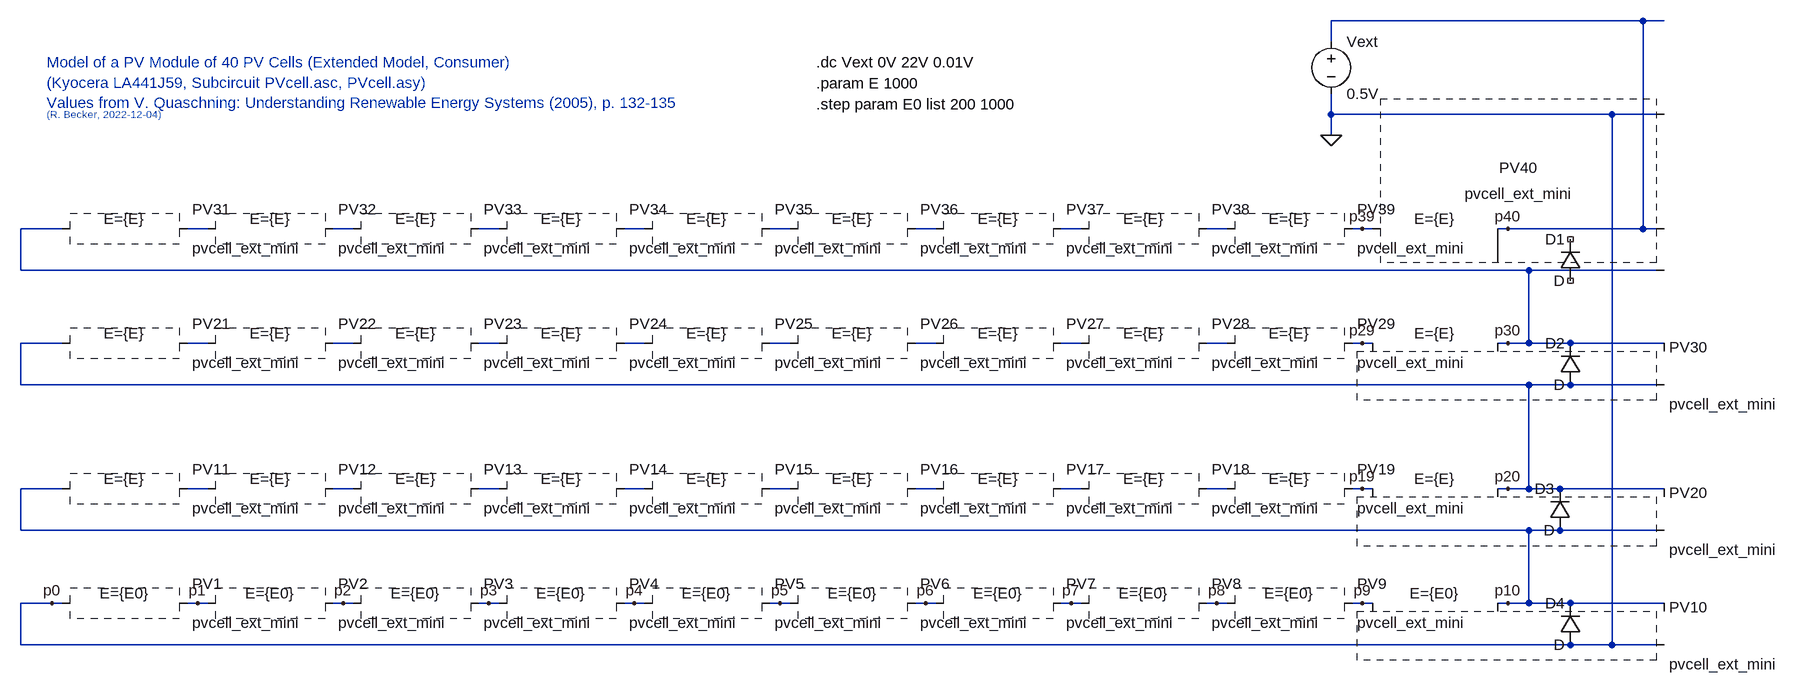
[diagram p0: schematic PVmodule_40_PVcell_Ext_Mini_V002.asc]
PVmodule_40_PVcell_Ext_Mini_V002.asc, the LTspice schematic file:
Version 4
SHEET 1 2048 1588
WIRE 1920 -16 1440 -16
WIRE 1952 -16 1920 -16
WIRE 1440 16 1440 -16
WIRE 1440 128 1440 96
WIRE 1872 128 1440 128
WIRE 1952 128 1872 128
WIRE 1440 160 1440 128
WIRE -512 304 -576 304
WIRE -288 304 -320 304
WIRE -64 304 -96 304
WIRE 160 304 128 304
WIRE 384 304 352 304
WIRE 608 304 576 304
WIRE 832 304 800 304
WIRE 1056 304 1024 304
WIRE 1280 304 1248 304
WIRE 1488 304 1472 304
WIRE 1504 304 1488 304
WIRE 1712 304 1696 304
WIRE 1920 304 1920 -16
WIRE 1920 304 1712 304
WIRE 1952 304 1920 304
WIRE -576 368 -576 304
WIRE 1744 368 -576 368
WIRE 1952 368 1744 368
WIRE -512 480 -576 480
WIRE -288 480 -320 480
WIRE -64 480 -96 480
WIRE 160 480 128 480
WIRE 384 480 352 480
WIRE 608 480 576 480
WIRE 832 480 800 480
WIRE 1056 480 1024 480
WIRE 1280 480 1248 480
WIRE 1488 480 1472 480
WIRE 1504 480 1488 480
WIRE 1712 480 1696 480
WIRE 1744 480 1744 368
WIRE 1744 480 1712 480
WIRE 1808 480 1744 480
WIRE 1952 480 1808 480
WIRE -576 544 -576 480
WIRE 1744 544 -576 544
WIRE 1808 544 1744 544
WIRE 1952 544 1808 544
WIRE -512 704 -576 704
WIRE -288 704 -320 704
WIRE -64 704 -96 704
WIRE 160 704 128 704
WIRE 384 704 352 704
WIRE 608 704 576 704
WIRE 832 704 800 704
WIRE 1056 704 1024 704
WIRE 1280 704 1248 704
WIRE 1488 704 1472 704
WIRE 1504 704 1488 704
WIRE 1712 704 1696 704
WIRE 1744 704 1744 544
WIRE 1744 704 1712 704
WIRE 1792 704 1744 704
WIRE 1952 704 1792 704
WIRE -576 768 -576 704
WIRE 1744 768 -576 768
WIRE 1792 768 1744 768
WIRE 1952 768 1792 768
WIRE -528 880 -576 880
WIRE -512 880 -528 880
WIRE -304 880 -320 880
WIRE -288 880 -304 880
WIRE -80 880 -96 880
WIRE -64 880 -80 880
WIRE 144 880 128 880
WIRE 160 880 144 880
WIRE 368 880 352 880
WIRE 384 880 368 880
WIRE 592 880 576 880
WIRE 608 880 592 880
WIRE 816 880 800 880
WIRE 832 880 816 880
WIRE 1040 880 1024 880
WIRE 1056 880 1040 880
WIRE 1264 880 1248 880
WIRE 1280 880 1264 880
WIRE 1488 880 1472 880
WIRE 1504 880 1488 880
WIRE 1712 880 1696 880
WIRE 1744 880 1744 768
WIRE 1744 880 1712 880
WIRE 1808 880 1744 880
WIRE 1952 880 1808 880
WIRE -576 944 -576 880
WIRE 1808 944 -576 944
WIRE 1872 944 1872 128
WIRE 1872 944 1808 944
WIRE 1952 944 1872 944
FLAG 1440 160 0
FLAG -528 880 p0
FLAG -304 880 p1
FLAG -80 880 p2
FLAG 144 880 p3
FLAG 368 880 p4
FLAG 592 880 p5
FLAG 816 880 p6
FLAG 1040 880 p7
FLAG 1264 880 p8
FLAG 1488 880 p9
FLAG 1712 880 p10
FLAG 1488 704 p19
FLAG 1712 704 p20
FLAG 1712 480 p30
FLAG 1712 304 p40
FLAG 1488 480 p29
FLAG 1488 304 p39
SYMBOL voltage 1440 0 R0
WINDOW 123 0 0 Left 2
WINDOW 39 0 0 Left 2
SYMATTR InstName Vext
SYMATTR Value 0.5V
SYMBOL pvcell_ext_mini -416 880 R0
WINDOW 39 -1 0 Bottom 2
SYMATTR SpiceLine E={E0}
SYMATTR InstName PV1
SYMBOL pvcell_ext_mini -192 880 R0
WINDOW 39 -1 0 Bottom 2
SYMATTR SpiceLine E={E0}
SYMATTR InstName PV2
SYMBOL pvcell_ext_mini 32 880 R0
WINDOW 39 -1 0 Bottom 2
SYMATTR SpiceLine E={E0}
SYMATTR InstName PV3
SYMBOL pvcell_ext_mini 256 880 R0
WINDOW 39 -1 0 Bottom 2
SYMATTR SpiceLine E={E0}
SYMATTR InstName PV4
SYMBOL pvcell_ext_mini 480 880 R0
WINDOW 39 -1 0 Bottom 2
SYMATTR SpiceLine E={E0}
SYMATTR InstName PV5
SYMBOL pvcell_ext_mini 704 880 R0
WINDOW 39 -1 0 Bottom 2
SYMATTR SpiceLine E={E0}
SYMATTR InstName PV6
SYMBOL pvcell_ext_mini 928 880 R0
WINDOW 39 -1 0 Bottom 2
SYMATTR SpiceLine E={E0}
SYMATTR InstName PV7
SYMBOL pvcell_ext_mini 1152 880 R0
WINDOW 39 -1 0 Bottom 2
SYMATTR SpiceLine E={E0}
SYMATTR InstName PV8
SYMBOL pvcell_ext_mini 1376 880 R0
WINDOW 39 -1 0 Bottom 2
SYMATTR SpiceLine E={E0}
SYMATTR InstName PV9
SYMBOL pvcell_ext_mini 1600 880 R0
WINDOW 39 -1 0 Bottom 2
SYMATTR SpiceLine E={E0}
SYMATTR InstName PV10
SYMBOL pvcell_ext_mini -416 704 R0
WINDOW 39 -1 0 Bottom 2
SYMATTR SpiceLine E={E}
SYMATTR InstName PV11
SYMBOL pvcell_ext_mini -192 704 R0
WINDOW 39 -1 0 Bottom 2
SYMATTR SpiceLine E={E}
SYMATTR InstName PV12
SYMBOL pvcell_ext_mini 32 704 R0
WINDOW 39 -1 0 Bottom 2
SYMATTR SpiceLine E={E}
SYMATTR InstName PV13
SYMBOL pvcell_ext_mini 256 704 R0
WINDOW 39 -1 0 Bottom 2
SYMATTR SpiceLine E={E}
SYMATTR InstName PV14
SYMBOL pvcell_ext_mini 480 704 R0
WINDOW 39 -1 0 Bottom 2
SYMATTR SpiceLine E={E}
SYMATTR InstName PV15
SYMBOL pvcell_ext_mini 704 704 R0
WINDOW 39 -1 0 Bottom 2
SYMATTR SpiceLine E={E}
SYMATTR InstName PV16
SYMBOL pvcell_ext_mini 928 704 R0
WINDOW 39 -1 0 Bottom 2
SYMATTR SpiceLine E={E}
SYMATTR InstName PV17
SYMBOL pvcell_ext_mini 1152 704 R0
WINDOW 39 -1 0 Bottom 2
SYMATTR SpiceLine E={E}
SYMATTR InstName PV18
SYMBOL pvcell_ext_mini 1376 704 R0
WINDOW 39 -1 0 Bottom 2
SYMATTR SpiceLine E={E}
SYMATTR InstName PV19
SYMBOL pvcell_ext_mini 1600 704 R0
WINDOW 39 -1 0 Bottom 2
SYMATTR SpiceLine E={E}
SYMATTR InstName PV20
SYMBOL pvcell_ext_mini -416 480 R0
WINDOW 39 -1 0 Bottom 2
SYMATTR SpiceLine E={E}
SYMATTR InstName PV21
SYMBOL pvcell_ext_mini -192 480 R0
WINDOW 39 -1 0 Bottom 2
SYMATTR SpiceLine E={E}
SYMATTR InstName PV22
SYMBOL pvcell_ext_mini 32 480 R0
WINDOW 39 -1 0 Bottom 2
SYMATTR SpiceLine E={E}
SYMATTR InstName PV23
SYMBOL pvcell_ext_mini 256 480 R0
WINDOW 39 -1 0 Bottom 2
SYMATTR SpiceLine E={E}
SYMATTR InstName PV24
SYMBOL pvcell_ext_mini 480 480 R0
WINDOW 39 -1 0 Bottom 2
SYMATTR SpiceLine E={E}
SYMATTR InstName PV25
SYMBOL pvcell_ext_mini 704 480 R0
WINDOW 39 -1 0 Bottom 2
SYMATTR SpiceLine E={E}
SYMATTR InstName PV26
SYMBOL pvcell_ext_mini 928 480 R0
WINDOW 39 -1 0 Bottom 2
SYMATTR SpiceLine E={E}
SYMATTR InstName PV27
SYMBOL pvcell_ext_mini 1152 480 R0
WINDOW 39 -1 0 Bottom 2
SYMATTR SpiceLine E={E}
SYMATTR InstName PV28
SYMBOL pvcell_ext_mini 1376 480 R0
WINDOW 39 -1 0 Bottom 2
SYMATTR SpiceLine E={E}
SYMATTR InstName PV29
SYMBOL pvcell_ext_mini 1600 480 R0
WINDOW 39 -1 0 Bottom 2
SYMATTR SpiceLine E={E}
SYMATTR InstName PV30
SYMBOL pvcell_ext_mini -416 304 R0
WINDOW 39 -1 0 Bottom 2
SYMATTR SpiceLine E={E}
SYMATTR InstName PV31
SYMBOL pvcell_ext_mini -192 304 R0
WINDOW 39 -1 0 Bottom 2
SYMATTR SpiceLine E={E}
SYMATTR InstName PV32
SYMBOL pvcell_ext_mini 32 304 R0
WINDOW 39 -1 0 Bottom 2
SYMATTR SpiceLine E={E}
SYMATTR InstName PV33
SYMBOL pvcell_ext_mini 256 304 R0
WINDOW 39 -1 0 Bottom 2
SYMATTR SpiceLine E={E}
SYMATTR InstName PV34
SYMBOL pvcell_ext_mini 480 304 R0
WINDOW 39 -1 0 Bottom 2
SYMATTR SpiceLine E={E}
SYMATTR InstName PV35
SYMBOL pvcell_ext_mini 704 304 R0
WINDOW 39 -1 0 Bottom 2
SYMATTR SpiceLine E={E}
SYMATTR InstName PV36
SYMBOL pvcell_ext_mini 928 304 R0
WINDOW 39 -1 0 Bottom 2
SYMATTR SpiceLine E={E}
SYMATTR InstName PV37
SYMBOL pvcell_ext_mini 1152 304 R0
WINDOW 39 -1 0 Bottom 2
SYMATTR SpiceLine E={E}
SYMATTR InstName PV38
SYMBOL pvcell_ext_mini 1376 304 R0
WINDOW 39 -1 0 Bottom 2
SYMATTR SpiceLine E={E}
SYMATTR InstName PV39
SYMBOL pvcell_ext_mini 1600 304 R0
WINDOW 39 -1 0 Bottom 2
SYMATTR SpiceLine E={E}
SYMATTR InstName PV40
SYMBOL diode 1824 384 R180
WINDOW 0 24 64 Left 2
WINDOW 3 24 0 Left 2
SYMATTR InstName D1
SYMBOL diode 1824 544 R180
WINDOW 0 24 64 Left 2
WINDOW 3 24 0 Left 2
SYMATTR InstName D2
SYMBOL diode 1808 768 R180
WINDOW 0 24 64 Left 2
WINDOW 3 24 0 Left 2
SYMATTR InstName D3
SYMBOL diode 1824 944 R180
WINDOW 0 24 64 Left 2
WINDOW 3 24 0 Left 2
SYMATTR InstName D4
TEXT 648 48 Left 2 !.dc Vext 0V 22V 0.01V
TEXT 648 112 Left 2 !.step param E0 list 200 1000
TEXT -536 48 Left 2 ;Model of a PV Module of 40 PV Cells (Extended Model, Consumer) \n(Kyocera LA441J59, Subcircuit PVcell.asc, PVcell.asy)\nValues from V. Quaschning: Understanding Renewable Energy Systems (2005), p. 132-135
TEXT -536 128 Left 1 ;(R. Becker, 2022-12-04)
TEXT 648 80 Left 2 !.param E 1000

The netlist it stands for:
* PVmodule_40_PVcell_Ext_Mini_V002.asc
Vext p40 0 0.5V
* PV1: pvcell_ext_mini E={E0} (symbol pvcell_ext_mini not available, pin order unknown); nets seen at it: 0, p1
* PV2: pvcell_ext_mini E={E0} (symbol pvcell_ext_mini not available, pin order unknown); nets seen at it: p1, p2
* PV3: pvcell_ext_mini E={E0} (symbol pvcell_ext_mini not available, pin order unknown); nets seen at it: p2, p3
* PV4: pvcell_ext_mini E={E0} (symbol pvcell_ext_mini not available, pin order unknown); nets seen at it: p3, p4
* PV5: pvcell_ext_mini E={E0} (symbol pvcell_ext_mini not available, pin order unknown); nets seen at it: p4, p5
* PV6: pvcell_ext_mini E={E0} (symbol pvcell_ext_mini not available, pin order unknown); nets seen at it: p5, p6
* PV7: pvcell_ext_mini E={E0} (symbol pvcell_ext_mini not available, pin order unknown); nets seen at it: p6, p7
* PV8: pvcell_ext_mini E={E0} (symbol pvcell_ext_mini not available, pin order unknown); nets seen at it: p7, p8
* PV9: pvcell_ext_mini E={E0} (symbol pvcell_ext_mini not available, pin order unknown); nets seen at it: p8, p9
* PV10: pvcell_ext_mini E={E0} (symbol pvcell_ext_mini not available, pin order unknown); nets seen at it: 0, p10, p9
* PV11: pvcell_ext_mini E={E} (symbol pvcell_ext_mini not available, pin order unknown); nets seen at it: N017, p10
* PV12: pvcell_ext_mini E={E} (symbol pvcell_ext_mini not available, pin order unknown); nets seen at it: N017, N018
* PV13: pvcell_ext_mini E={E} (symbol pvcell_ext_mini not available, pin order unknown); nets seen at it: N018, N019
* PV14: pvcell_ext_mini E={E} (symbol pvcell_ext_mini not available, pin order unknown); nets seen at it: N019, N020
* PV15: pvcell_ext_mini E={E} (symbol pvcell_ext_mini not available, pin order unknown); nets seen at it: N020, N021
* PV16: pvcell_ext_mini E={E} (symbol pvcell_ext_mini not available, pin order unknown); nets seen at it: N021, N022
* PV17: pvcell_ext_mini E={E} (symbol pvcell_ext_mini not available, pin order unknown); nets seen at it: N022, N023
* PV18: pvcell_ext_mini E={E} (symbol pvcell_ext_mini not available, pin order unknown); nets seen at it: N023, N024
* PV19: pvcell_ext_mini E={E} (symbol pvcell_ext_mini not available, pin order unknown); nets seen at it: N024, p19
* PV20: pvcell_ext_mini E={E} (symbol pvcell_ext_mini not available, pin order unknown); nets seen at it: p10, p19, p20
* PV21: pvcell_ext_mini E={E} (symbol pvcell_ext_mini not available, pin order unknown); nets seen at it: N009, p20
* PV22: pvcell_ext_mini E={E} (symbol pvcell_ext_mini not available, pin order unknown); nets seen at it: N009, N010
* PV23: pvcell_ext_mini E={E} (symbol pvcell_ext_mini not available, pin order unknown); nets seen at it: N010, N011
* PV24: pvcell_ext_mini E={E} (symbol pvcell_ext_mini not available, pin order unknown); nets seen at it: N011, N012
* PV25: pvcell_ext_mini E={E} (symbol pvcell_ext_mini not available, pin order unknown); nets seen at it: N012, N013
* PV26: pvcell_ext_mini E={E} (symbol pvcell_ext_mini not available, pin order unknown); nets seen at it: N013, N014
* PV27: pvcell_ext_mini E={E} (symbol pvcell_ext_mini not available, pin order unknown); nets seen at it: N014, N015
* PV28: pvcell_ext_mini E={E} (symbol pvcell_ext_mini not available, pin order unknown); nets seen at it: N015, N016
* PV29: pvcell_ext_mini E={E} (symbol pvcell_ext_mini not available, pin order unknown); nets seen at it: N016, p29
* PV30: pvcell_ext_mini E={E} (symbol pvcell_ext_mini not available, pin order unknown); nets seen at it: p20, p29, p30
* PV31: pvcell_ext_mini E={E} (symbol pvcell_ext_mini not available, pin order unknown); nets seen at it: N001, p30
* PV32: pvcell_ext_mini E={E} (symbol pvcell_ext_mini not available, pin order unknown); nets seen at it: N001, N002
* PV33: pvcell_ext_mini E={E} (symbol pvcell_ext_mini not available, pin order unknown); nets seen at it: N002, N003
* PV34: pvcell_ext_mini E={E} (symbol pvcell_ext_mini not available, pin order unknown); nets seen at it: N003, N004
* PV35: pvcell_ext_mini E={E} (symbol pvcell_ext_mini not available, pin order unknown); nets seen at it: N004, N005
* PV36: pvcell_ext_mini E={E} (symbol pvcell_ext_mini not available, pin order unknown); nets seen at it: N005, N006
* PV37: pvcell_ext_mini E={E} (symbol pvcell_ext_mini not available, pin order unknown); nets seen at it: N006, N007
* PV38: pvcell_ext_mini E={E} (symbol pvcell_ext_mini not available, pin order unknown); nets seen at it: N007, N008
* PV39: pvcell_ext_mini E={E} (symbol pvcell_ext_mini not available, pin order unknown); nets seen at it: N008, p39
* PV40: pvcell_ext_mini E={E} (symbol pvcell_ext_mini not available, pin order unknown); nets seen at it: 0, p30, p39, p40
D1 NC_01 NC_02 D
D2 p20 p30 D
D3 p10 p20 D
D4 0 p10 D
.model D D
.lib standard.dio
.dc Vext 0V 22V 0.01V
.step param E0 list 200 1000
* Model of a PV Module of 40 PV Cells (Extended Model, Consumer)
* (Kyocera LA441J59, Subcircuit PVcell.asc, PVcell.asy)
* Values from V. Quaschning: Understanding Renewable Energy Systems (2005), p. 132-135
* (R. Becker, 2022-12-04)
.param E 1000
.backanno
.end